# Altium schematic sheet 10-DigitalToAnalogConvert.SchDoc
size A
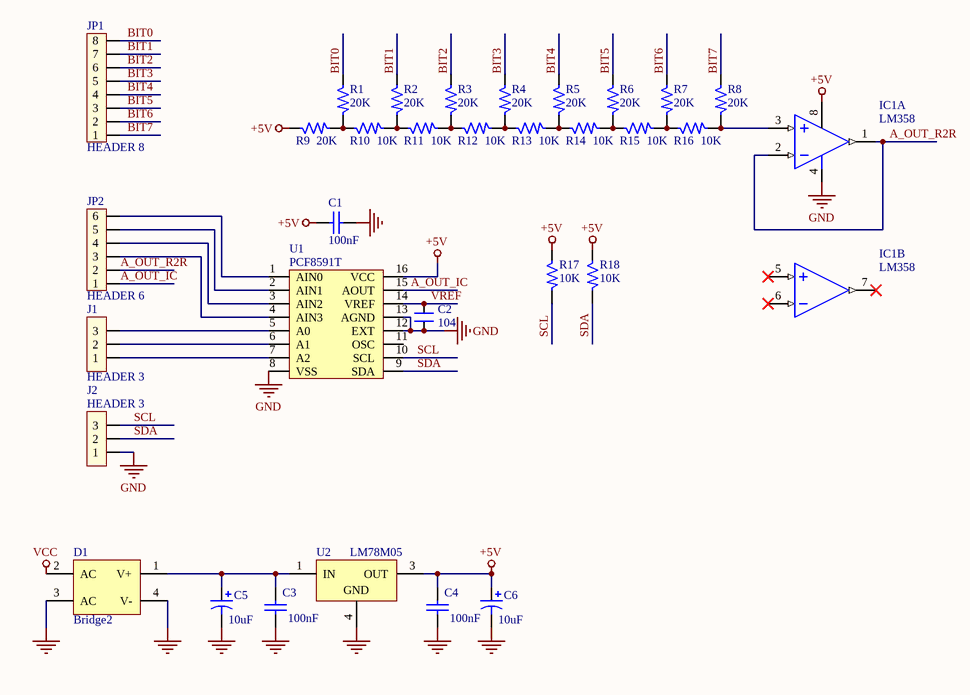
[diagram p0: 10-DigitalToAnalogConvert.SchDoc]

## Parts
C1  value 100nF  [RAD-0.3]  (hidden comment: 104)
C2  104  [C-0805]
C3  value 100nF  [RAD-0.3]  (hidden comment: 104)
C4  value 100nF  [RAD-0.3]  (hidden comment: 104)
C5  value 10uF  [RB7.6-15]  (hidden comment: 10uF/16V)
C6  value 10uF  [RB7.6-15]  (hidden comment: 10uF/16V)
D1  Bridge2  [D-46_6A]
IC1  LM358  [SOP-8]  (parts A,B of 2)
J1  HEADER 3  [JP3]
J2  HEADER 3  [JP3]
JP1  HEADER 8  [JP8]
JP2  HEADER 6  [JP6]
R1  20K  [R-0805]
R2  20K  [R-0805]
R3  20K  [R-0805]
R4  20K  [R-0805]
R5  20K  [R-0805]
R6  20K  [R-0805]
R7  20K  [R-0805]
R8  20K  [R-0805]
R9  20K  [R-0805]
R10  10K  [R-0805]
R11  10K  [R-0805]
R12  10K  [R-0805]
R13  10K  [R-0805]
R14  10K  [R-0805]
R15  10K  [R-0805]
R16  10K  [R-0805]
R17  10K  [R-0805]
R18  10K  [R-0805]
U1  PCF8591T  [SO-16]
U2  value LM78M05  [NDP0003B_M]  (hidden comment: LM78M05CDTX)

## Nets
+5V: C1.1 C4.1 C6.1 IC1.8(+V) R9.1 R17.1 R18.1 U1.16(VCC) U2.3(OUT)
GND: C1.2 C2.1 C3.2 C4.2 C5.2 C6.2 D1.3(AC) D1.4(V-) IC1.4(-V) J2.1 U1.8(VSS) U1.12(EXT) U1.13(AGND) U2.4(GND)
VCC: D1.2(AC)
A_OUT_IC: JP2.1 U1.15(AOUT)
A_OUT_R2R: IC1.1(OUT) IC1.2(IN-) JP2.2
BIT0: JP1.8 R1.1
BIT1: JP1.7 R2.1
BIT2: JP1.6 R3.1
BIT3: JP1.5 R4.1
BIT4: JP1.4 R5.1
BIT5: JP1.3 R6.1
BIT6: JP1.2 R7.1
BIT7: JP1.1 R8.1
SCL: J2.3 R17.2 U1.10(SCL)
SDA: J2.2 R18.2 U1.9(SDA)
VREF: C2.2 U1.14(VREF)
NetC3_1: C3.1 C5.1 D1.1(V+) U2.1(IN)
NetIC1_3: IC1.3(IN+) R8.2 R16.2
NetJ1_1: J1.1 U1.7(A2)
NetJ1_2: J1.2 U1.6(A1)
NetJ1_3: J1.3 U1.5(A0)
NetJP2_3: JP2.3 U1.4(AIN3)
NetJP2_4: JP2.4 U1.3(AIN2)
NetJP2_5: JP2.5 U1.2(AIN1)
NetJP2_6: JP2.6 U1.1(AIN0)
NetR1_2: R1.2 R9.2 R10.1
NetR2_2: R2.2 R10.2 R11.1
NetR3_2: R3.2 R11.2 R12.1
NetR4_2: R4.2 R12.2 R13.1
NetR5_2: R5.2 R13.2 R14.1
NetR6_2: R6.2 R14.2 R15.1
NetR7_2: R7.2 R15.2 R16.1

Not connected (* = marked no-connect by the designer): IC1 5(IN+)* 6(IN-)* 7(OUT)*; U1 11(OSC)

## Library data of the parts
C1 C3 C4 = Cap: Capacitor; Published: 8-Jun-2000; LatestRevisionDate: 17-Jul-2002; LatestRevisionNote: Re-released for DXP Platform.; PackageReference: RAD-0.3; Publisher: Altium Limited; PackageDescription: Radial Cap, Thru-Hole; 2 Leads; 0.3 in Pin Spacing
C2 = CN: Value: 0,1uF/300V; Designed by: VanDungEvn
C5 C6 = Cap Pol1: Polarized Capacitor (Radial); Published: 8-Jun-2000; LatestRevisionDate: 17-Jul-2002; LatestRevisionNote: Re-released for DXP Platform.; PackageReference: RB7.6-15; Publisher: Altium Limited; PackageDescription: Polarized Capacitor (Radial); 2 Leads
D1 = Bridge2: Diode Bridge; Published: 24-Mar-1999; LatestRevisionDate: 17-Jul-2002; LatestRevisionNote: Re-released for DXP Platform.; PackageReference: D-46_6A; Publisher: Altium Limited; PackageDescription: Bridge Rectifier; 4 Terminals; Body 16.8 x 16.8 mm (typ); Pitch 10.67 mm
IC1 = LM358: Low-Power Dual Operational Amplifier; Value: LM358
J1 J2 = JP3: Jumper 3; Value: J3
JP1 = JP8: JP8 PIN; Value: JP7
JP2 = JP6: JP6 PIN; Value: JP7
R1-R18 = R: Resistor 1/4W; Value: R1/4W - 1K
U2 = CMP-0062-00204-3: 3-Terminal Positive Voltage Regulators, 3-pin TO-252; Manufacturer: Texas Instruments; PackageTopMarking: NSUZXYTT*LM78M05*CDT; PowerWise: N; CompType: LDO IC; ComponentLink1Description: Datasheet URL; ComponentLink1URL: http://www.ti.com/general/docs/lit/getliterature.tsp?genericPartNumber=LM78M05&fileType=pdf; PackageReference: NDP0003B; Code_JEDEC: TO-252-AA; PinCount: 3; PackageDescription: TO252, Molded, Jedec, 6.8 x 6.10 x 2.30mm Body, 3 Lead, 2.28mm Pitch, Surface Mount
U1 = PCF8591T: Value: PCF8591T